# EAGLE design utophuile_i2c (EAGLE 5.07)
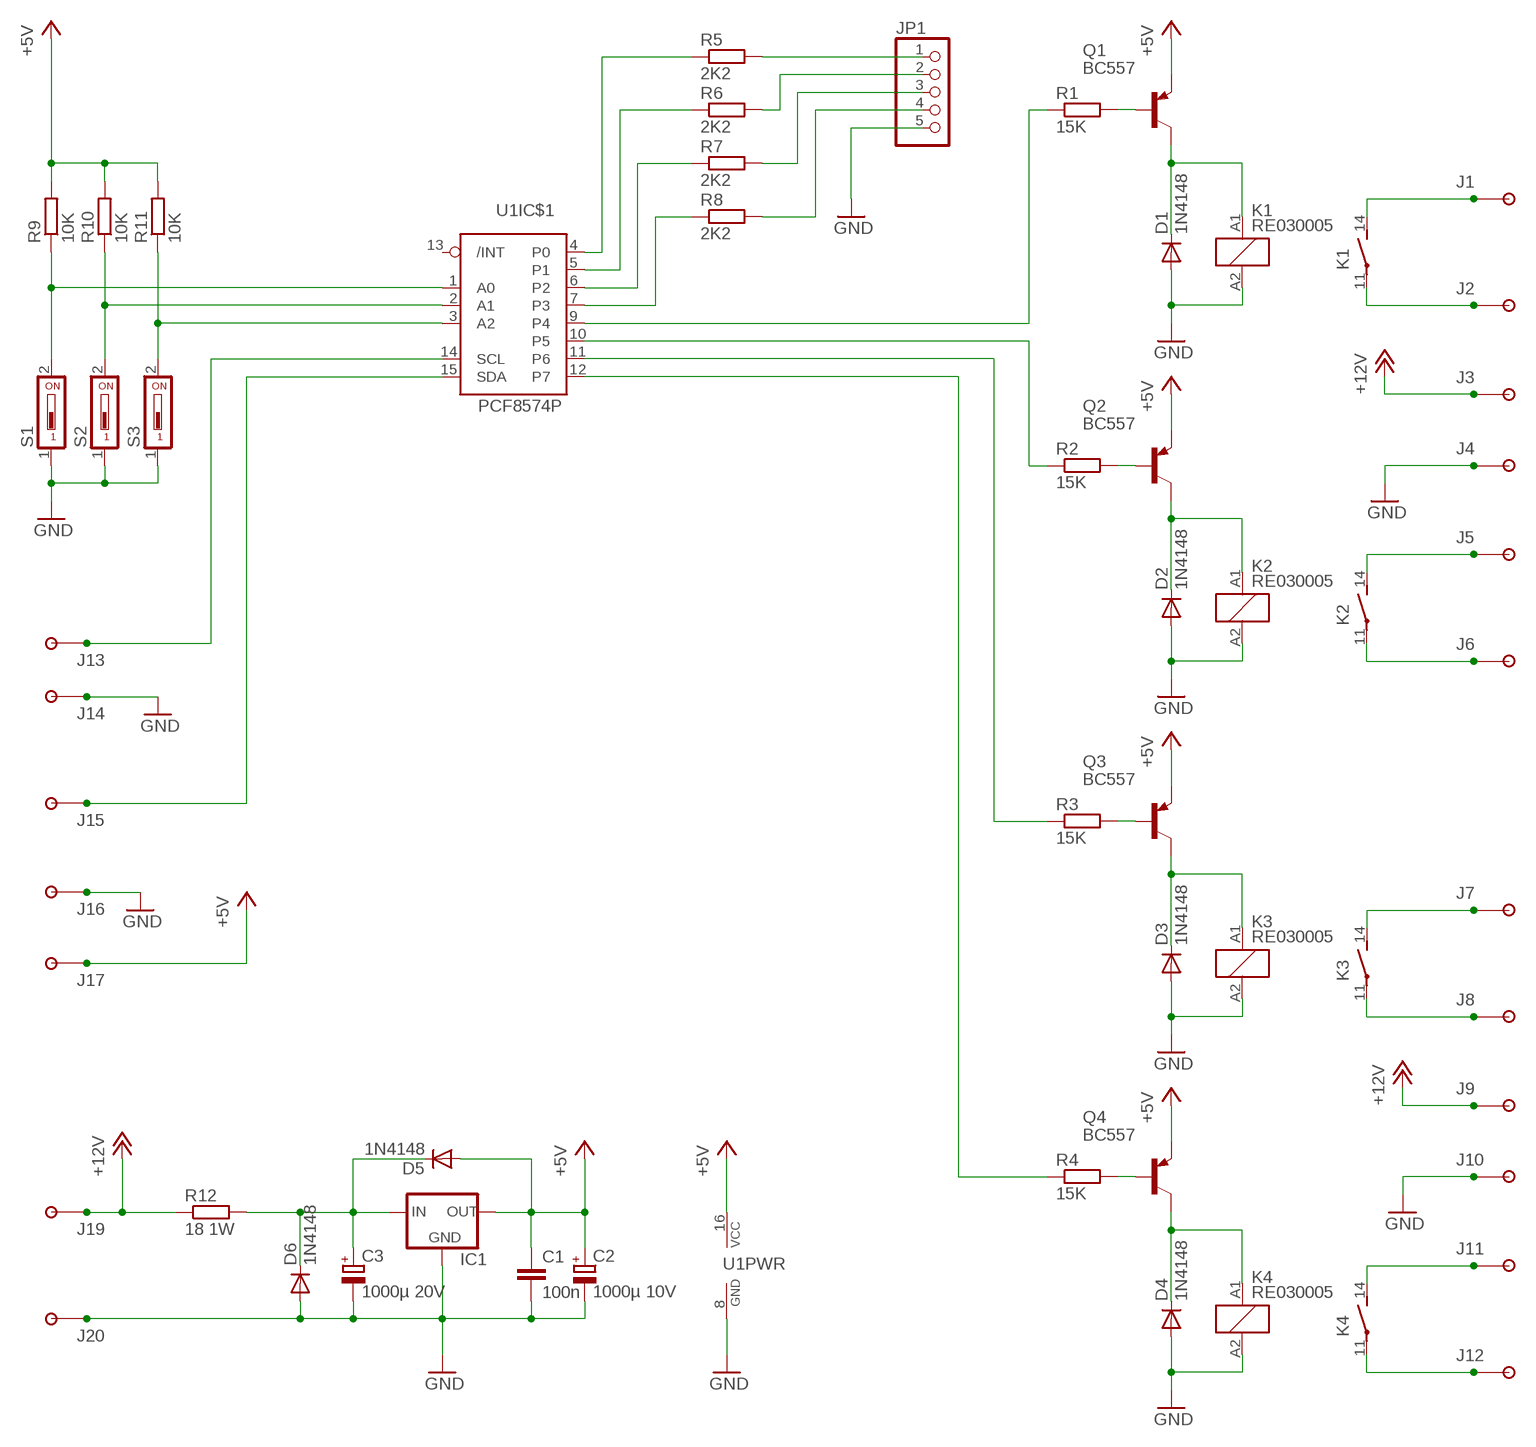
[diagram p0: schematic, sheet 1]

## Parts
C1  100n  C-EU050-025X075  [C050-025X075]
C2  1000µ 10V  CPOL-EUE3.5-10  [E3,5-10]
C3  1000µ 20V  CPOL-EUE3.5-10  [E3,5-10]
D1  1N4148  [DO35-10]
D2  1N4148  [DO35-10]
D3  1N4148  [DO35-10]
D4  1N4148  [DO35-10]
D5  1N4148  [DO35-10]
D6  1N4148  [DO35-10]
IC1  78MXXS  [78MXXS]
J1  BORN_VIS2  [BORN_VIS]
J2  BORN_VIS2  [BORN_VIS]
J3  BORN_VIS2  [BORN_VIS]
J4  BORN_VIS2  [BORN_VIS]
J5  BORN_VIS2  [BORN_VIS]
J6  BORN_VIS2  [BORN_VIS]
J7  BORN_VIS2  [BORN_VIS]
J8  BORN_VIS2  [BORN_VIS]
J9  BORN_VIS2  [BORN_VIS]
J10  BORN_VIS2  [BORN_VIS]
J11  BORN_VIS2  [BORN_VIS]
J12  BORN_VIS2  [BORN_VIS]
J13  BORN_VIS2  [BORN_VIS]
J14  BORN_VIS2  [BORN_VIS]
J15  BORN_VIS2  [BORN_VIS]
J16  BORN_VIS2  [BORN_VIS]
J17  BORN_VIS2  [BORN_VIS]
J19  BORN_VIS2  [BORN_VIS]
J20  BORN_VIS2  [BORN_VIS]
JP1  PINHD-1X5  [1X05]
K1  RE030005  [RE-SCHRACK]
K2  RE030005  [RE-SCHRACK]
K3  RE030005  [RE-SCHRACK]
K4  RE030005  [RE-SCHRACK]
Q1  BC557  [TO92-EBC]
Q2  BC557  [TO92-EBC]
Q3  BC557  [TO92-EBC]
Q4  BC557  [TO92-EBC]
R1  15K  R-EU_0207/10  [0207/10]
R2  15K  R-EU_0207/10  [0207/10]
R3  15K  R-EU_0207/10  [0207/10]
R4  15K  R-EU_0207/10  [0207/10]
R5  2K2  R-EU_0207/10  [0207/10]
R6  2K2  R-EU_0207/10  [0207/10]
R7  2K2  R-EU_0207/10  [0207/10]
R8  2K2  R-EU_0207/10  [0207/10]
R9  10K  R-EU_0207/10  [0207/10]
R10  10K  R-EU_0207/10  [0207/10]
R11  10K  R-EU_0207/10  [0207/10]
R12  18 1W  R-EU_0411/15  [0411/15]
S1  DS01  [DS-01]
S2  DS01  [DS-01]
S3  DS01  [DS-01]
U1  PCF8574P  [DIL16]

## Nets
+5V: C1.1 C2.+ D5.A IC1.OUT J17.P$1 J17.P$2 Q1.E Q2.E Q3.E Q4.E R9.2 R10.2 R11.2 U1.16(PWR:VCC)
+12V: J3.P$1 J3.P$2 J9.P$1 J9.P$2 J19.P$1 J19.P$2 R12.1
GND: C1.2 C2.- C3.- D1.A D2.A D3.A D4.A D6.A IC1.GND J4.P$1 J4.P$2 J10.P$1 J10.P$2 J14.P$1 J14.P$2 J16.P$1 J16.P$2 J20.P$1 J20.P$2 JP1.5 K1.A2 K2.A2 K3.A2 K4.A2 S1.1 S2.1 S3.1 U1.8(PWR:GND)
N$1: D4.C K4.A1 Q4.C
N$2: J11.P$1 J11.P$2 K4.14(2:S)
N$3: Q4.B R4.2
N$4: J12.P$1 J12.P$2 K4.11(2:P)
N$5: D1.C K1.A1 Q1.C
N$6: Q1.B R1.2
N$7: JP1.4 R8.2
N$8: J2.P$1 J2.P$2 K1.11(2:P)
N$9: D2.C K2.A1 Q2.C
N$10: Q2.B R2.2
N$11: J5.P$1 J5.P$2 K2.14(2:S)
N$12: J6.P$1 J6.P$2 K2.11(2:P)
N$13: D3.C K3.A1 Q3.C
N$14: Q3.B R3.2
N$15: J7.P$1 J7.P$2 K3.14(2:S)
N$16: J8.P$1 J8.P$2 K3.11(2:P)
N$17: R1.1 U1.9(IC$1:P4)
N$18: R2.1 U1.10(IC$1:P5)
N$19: R3.1 U1.11(IC$1:P6)
N$20: R4.1 U1.12(IC$1:P7)
N$21: JP1.1 R5.2
N$22: JP1.2 R6.2
N$23: JP1.3 R7.2
N$25: R5.1 U1.4(IC$1:P0)
N$26: R6.1 U1.5(IC$1:P1)
N$27: R7.1 U1.6(IC$1:P2)
N$28: R8.1 U1.7(IC$1:P3)
N$29: R9.1 S1.2 U1.1(IC$1:A0)
N$30: R10.1 S2.2 U1.2(IC$1:A1)
N$31: R11.1 S3.2 U1.3(IC$1:A2)
N$32: J1.P$1 J1.P$2 K1.14(2:S)
N$33: C3.+ D5.C D6.C IC1.IN R12.2
N$34: J13.P$1 J13.P$2 U1.14(IC$1:SCL)
N$35: J15.P$1 J15.P$2 U1.15(IC$1:SDA)
Unconnected: U1.13(IC$1:/INT)

## Library data of the parts
C1 = rcl:C-EU: CAPACITOR, European symbol
C2 C3 = rcl:CPOL-EU: POLARIZED CAPACITOR, European symbol
D1-D6 = diode:1N4148: DIODE high speed (Philips)
IC1 = v-reg:78MXXS: VOLTAGE REGULATOR
J1-J17 J19 J20 = bornnier_vis:BORN_VIS2
JP1 = pinhead:PINHD-1X5: PIN HEADER
K1-K4 = relay:RE03*: Miniature PCB Relay 1 pole 6 A SCHRACK Source: http://www.schrack.com/.. 5812.pdf
Q1-Q4 = transistor-pnp:BC557*: PNP Transistror
R1-R12 = rcl:R-EU_: RESISTOR, European symbol
S1-S3 = switch-dil:DS01: DIL/CODE SWITCH
U1 = i2c:PCF8574: Remote 8-Bit I/O Expander for I²C Bus

## Board
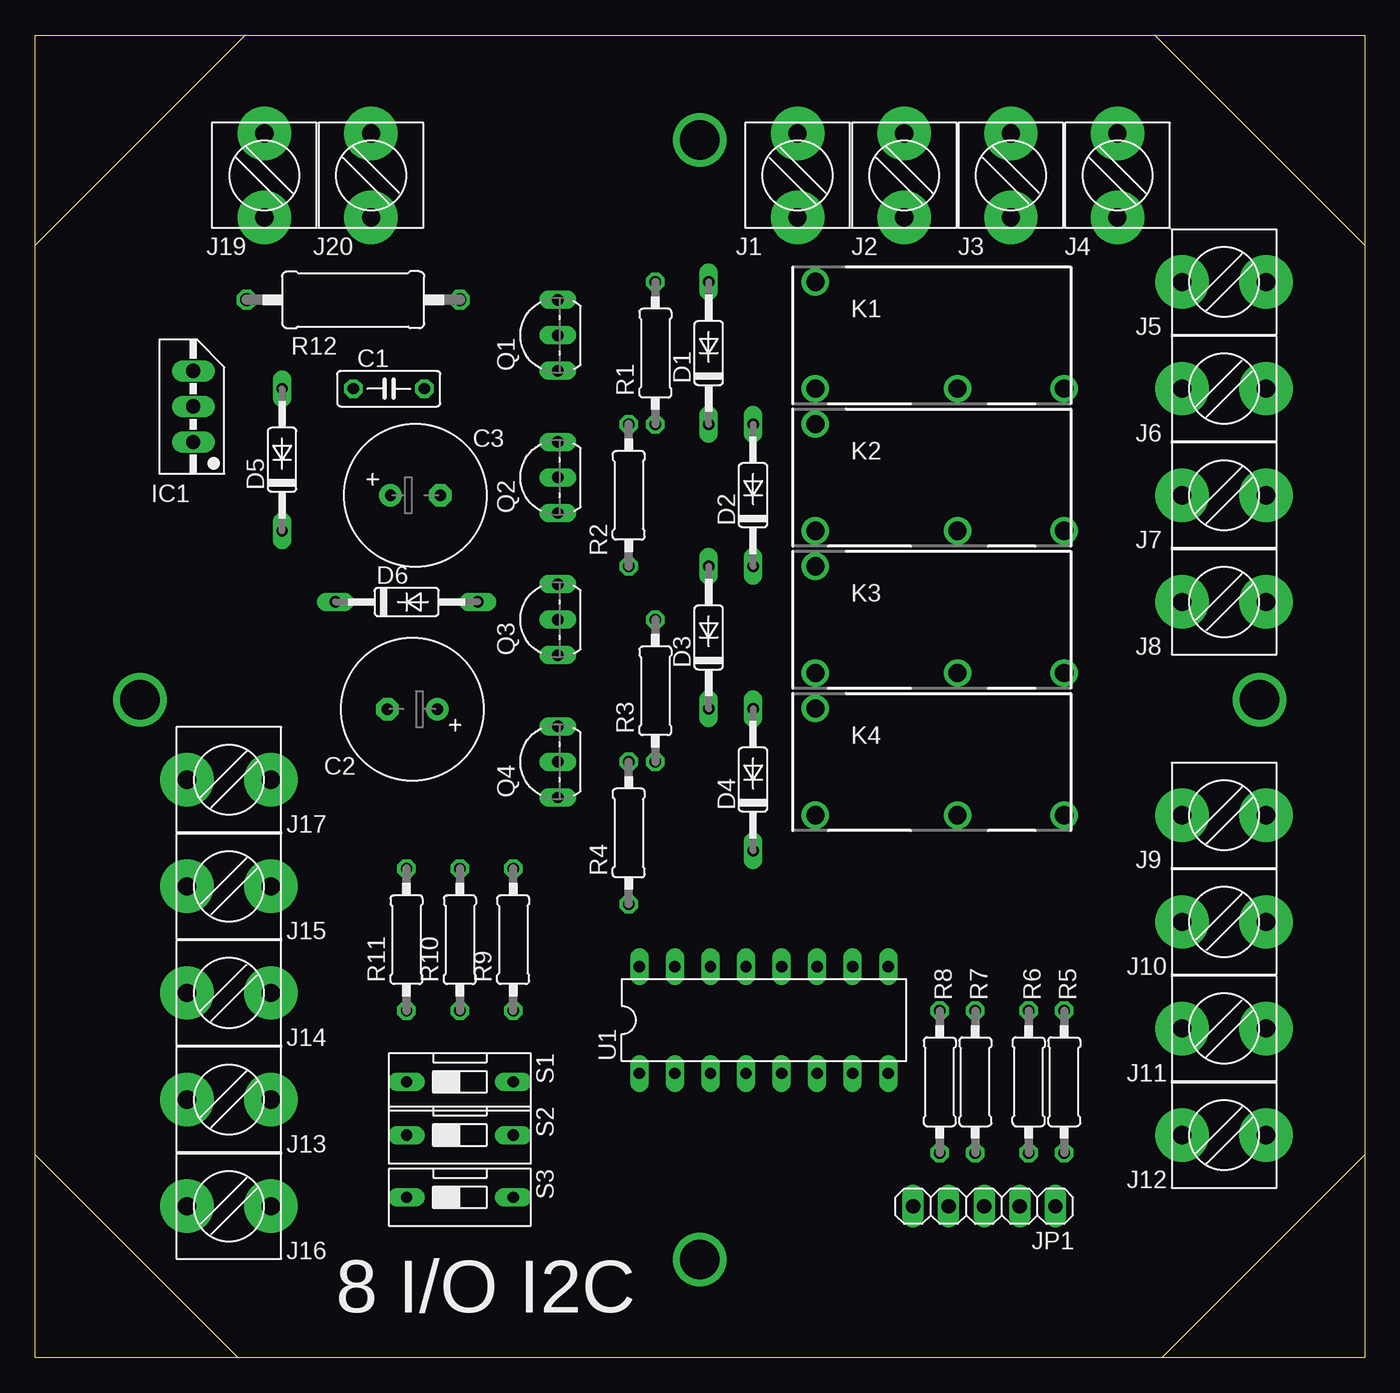
[diagram p1: board, top side]
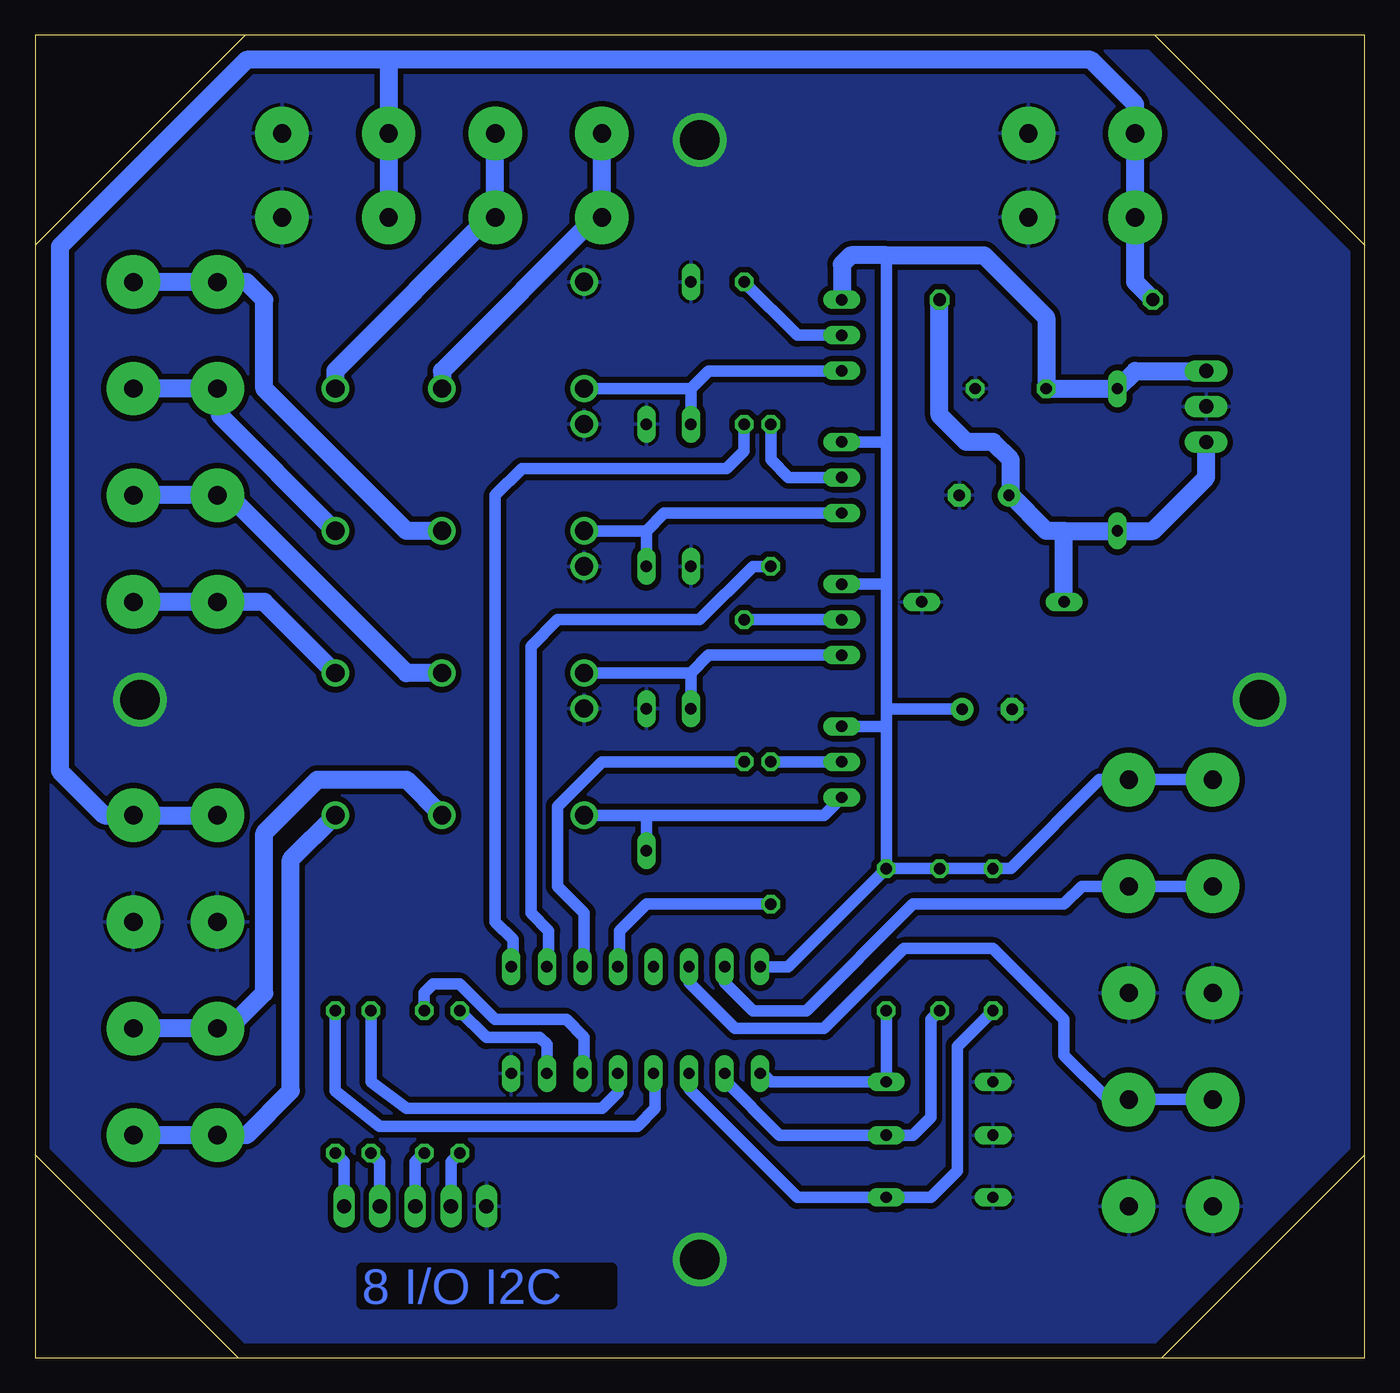
[diagram p2: board, bottom side, seen from below]

Size 95 x 94.5 mm. Coordinates in mm from the lower left corner, seen from the top.
Outline: 0,14.5 0,0 14.5,0
Outline: 0,14.5 0,79.5
Outline: 0,79.5 0,94.5 15,94.5
Outline: 15,94.5 80,94.5
Outline: 80,94.5 95,94.5 95,79.5
Outline: 95,79.5 95,14.5
Outline: 95,14.5 95,0 80.5,0
Outline: 80.5,0 14.5,0
Outline: 7.5,87 15,94.5
Outline: 15,94.5 0,79.5
Outline: 87.5,87 80,94.5
Outline: 80,94.5 95,79.5
Outline: 87.5,7 95,14.5
Outline: 95,14.5 80.5,0
Outline: 7.5,7 14.5,0
Outline: 14.5,0 0,14.5
Copper layers (1*16): Top 0.035mm / dielectric 1.5mm / Bottom 0.035mm
Design rules "default": minimum track width 10mil, minimum drill 24mil, track to track 8mil, track to pad 8mil, pad to pad 8mil, via to via 8mil, smd to smd 8mil, copper to edge 40mil, drill to drill 8mil, minimum pad ring 10mil, minimum via ring 8mil, stop-mask expansion 4mil, vias tented up to drill 0mil, thermal gap 10mil

### Footprints (pad centres in the part's own frame; a part is rotated, then mirrored left to right if it is on the bottom)
C050-025X075 = drill 0.813 octagon: 1 -2.54,0; 2 2.54,0
E3,5-10 = drill 0.813 pad 1.6 round: + -1.778,0 | drill 0.813 pad 1.6 octagon: - 1.778,0
DO35-10 = drill 0.813 long: A 5.08,0; C -5.08,0
78MXXS = drill 1.016 long: GND 0,-2.54; IN -2.54,-2.54; OUT 2.54,-2.54
BORN_VIS = drill 1.3 pad 3.81 round: P$1 -3,0; P$2 3,0
1X05 = drill 1.016 long: 1 -5.08,0; 2 -2.54,0; 3 0,0; 4 2.54,0; 5 5.08,0
RE-SCHRACK = drill 1.3 round: 11 8.89,-3.81; 14 1.27,-3.81; A1 -8.89,-3.81; A2 -8.89,3.81
TO92-EBC = drill 0.813 long: B 0,-1.27; C -2.54,-1.27; E 2.54,-1.27
0207/10 = drill 0.813 octagon: 1 -5.08,0; 2 5.08,0
0411/15 = drill 0.914 octagon: 1 -7.62,0; 2 7.62,0
DS-01 = drill 0.813 long: 1 0,-3.81; 2 0,3.81
DIL16 = drill 0.813 long: 1 -8.89,-3.81; 2 -6.35,-3.81; 3 -3.81,-3.81; 4 -1.27,-3.81; 5 1.27,-3.81; 6 3.81,-3.81; 7 6.35,-3.81; 8 8.89,-3.81; 9 8.89,3.81; 10 6.35,3.81; 11 3.81,3.81; 12 1.27,3.81; 13 -1.27,3.81; 14 -3.81,3.81; 15 -6.35,3.81; 16 -8.89,3.81

### Placement (x,y rotation side)
C1  25.28,69.23 0 top
C2  26.97,46.33 180 top
C3  27.18,61.61 0 top
D1  48.14,71.77 90 top
D2  51.31,61.61 90 top
D3  48.14,51.45 90 top
D4  51.31,41.29 90 top
D5  17.66,64.15 90 top
D6  26.55,53.99 0 top
IC1  8.77,67.96 90 top
J1  54.49,84.47 90 top
J2  62.11,84.47 90 top
J3  69.73,84.47 90 top
J4  77.35,84.47 90 top
J5  84.97,76.85 0 top
J6  84.97,69.23 0 top
J7  84.97,61.61 0 top
J8  84.97,53.99 0 top
J9  84.97,38.75 0 top
J10  84.97,31.13 0 top
J11  84.97,23.51 0 top
J12  84.97,15.89 0 top
J13  13.85,18.43 180 top
J14  13.85,26.05 180 top
J15  13.85,33.67 180 top
J16  13.85,10.81 180 top
J17  13.85,41.29 180 top
J19  16.39,84.47 90 top
J20  24.01,84.47 90 top
JP1  67.83,10.81 180 top
K1  64.65,73.04 0 top
K2  64.65,62.88 0 top
K3  64.65,52.72 0 top
K4  64.65,42.56 0 top
Q1  36.08,73.04 90 top
Q2  36.08,62.88 90 top
Q3  36.08,52.72 90 top
Q4  36.08,42.56 90 top
R1  44.33,71.77 90 top
R2  42.42,61.61 90 top
R3  44.33,47.64 90 top
R4  42.42,37.48 90 top
R5  73.54,19.7 270 top
R6  71,19.7 270 top
R7  67.19,19.7 270 top
R8  64.65,19.7 270 top
R9  34.17,29.86 90 top
R10  30.36,29.86 90 top
R11  26.55,29.86 90 top
R12  22.74,75.58 0 top
S1  30.36,19.7 270 top
S2  30.36,15.89 270 top
S3  30.36,11.45 270 top
U1  52.08,24.11 0 top

### Tracks (layer width: path | path; a pad name or v marks a point on that pad's centre or on a via)
+5V
  Bottom 0.813: 34.17,65.42 Q2.E | 34.17,65.42 34.17,78.75 | 34.17,55.26 Q3.E | 34.17,55.26 34.17,65.42 | 34.17,45.1 Q4.E | 34.17,45.1 34.17,46.37 | 34.17,46.37 34.17,55.26 | R9.2 34.17,45.1 | R9.2 R10.2 R11.2 25.28,34.94 18.93,41.29 J17.P$1 | C2.+ 34.12,46.33 34.17,46.37 | U1.16 41.19,27.92 R9.2 | J17.P$1 17.02,41.29 | J17.P$2 J17.P$1
  Bottom 1.27: IC1.OUT 16.39,70.5 D5.A C1.1 22.74,74.31 27.18,78.75 34.17,78.75 36.71,78.75 37.34,78.12 Q1.E
+12V
  Bottom 1.27: R12.1 16.39,76.85 J19.P$1 J19.P$2 16.39,87.64 | 16.39,87.64 16.39,88.28 | 81.8,38.75 J9.P$1 J9.P$2 90.05,38.75 93.22,41.92 93.22,79.39 79.89,92.72 69.73,92.72 | J3.P$1 J3.P$2 69.73,92.72 | 69.73,92.72 19.56,92.72 16.39,89.55 16.39,88.28 | 16.39,88.28 17.02,87.64 16.39,87.64
GND  (via drill 2.8 pad 3.81)
  other vias: 7.5,47 47.5,7 47.5,87 87.5,47
  pour Bottom (isolate 0.406): -0.12,14.62 -0.12,79.39 15.12,94.63 79.89,94.63 95.13,79.39 95.13,14.62 80.53,0.01 14.48,0.01
N$1
  Bottom 0.813: Q4.C 38.61,38.75 51.31,38.75 | 51.31,38.75 D4.C | 51.31,38.75 K4.A1
N$2
  Bottom 1.27: 88.78,23.51 J11.P$2 J11.P$1 81.16,23.51 78.62,26.05 78.62,37.48 74.81,41.29 68.46,41.29 K4.14
N$3
  Bottom 0.813: Q4.B R4.2
N$4
  Bottom 1.27: J12.P$2 J12.P$1 79.89,15.89 76.72,19.06 76.72,35.58 K4.11
N$5
  Bottom 0.813: Q1.C 46.87,70.5 48.14,69.23 | 48.14,69.23 D1.C | 48.14,69.23 K1.A1
N$6
  Bottom 0.813: Q1.B 40.52,73.04 R1.2
N$7
  Bottom 0.813: JP1.4 65.28,13.98 R8.2
N$8
  Bottom 1.27: 62.03,87.47 62,87.5 | 62.03,87.47 J2.P$2 | 62.11,81.93 62.11,87.39 62.03,87.47 | J2.P$1 62.11,81.93 | K1.11 73.54,70.5 62.11,81.93
N$9
  Bottom 0.813: Q2.C 50.05,60.34 51.31,59.07 | 51.31,59.07 D2.C | 51.31,59.07 K2.A1
N$10
  Bottom 0.813: Q2.B 41.16,62.88 42.42,64.15 R2.2
N$11
  Bottom 1.27: K2.14 68.46,59.07 78.62,69.23 78.62,75.58 79.89,76.85 J5.P$1 | J5.P$1 82.43,76.85 | J5.P$1 J5.P$2
N$12
  Bottom 1.27: 87.97,69.03 88,69 | 87.97,69.03 J6.P$2 J6.P$1 | 87.97,69.03 87.77,69.23 | K2.11 81.8,67.33 81.8,69.23 J6.P$1 | J6.P$1 82.43,69.23
N$13
  Bottom 0.813: Q3.C 46.87,50.18 48.14,48.91 | 48.14,48.91 D3.C | 48.14,48.91 K3.A1
N$14
  Bottom 0.813: Q3.B 43.7,52.72 R3.2
N$15
  Bottom 1.27: K3.14 68.46,48.91 81.16,61.61 J7.P$1 | J7.P$1 82.43,61.61 | J7.P$1 J7.P$2
N$16
  Bottom 1.27: 88,54 87.99,53.99 J8.P$2 J8.P$1 | K3.11 78.62,53.99 J8.P$1 | J8.P$1 82.43,53.99
N$17
  Bottom 0.813: R1.1 44.33,64.78 45.6,63.52 60.2,63.52 62.11,61.61 62.11,31.13 60.84,29.86 60.84,27.95 60.88,27.92 U1.9
N$18
  Bottom 0.813: U1.10 58.34,27.92 58.3,27.95 58.3,30.5 59.57,31.77 59.57,50.81 57.66,52.72 47.51,52.72 43.7,56.53 R2.1
N$19
  Bottom 0.813: R3.1 54.49,42.56 57.66,39.38 57.66,33.67 55.76,31.77 55.76,27.95 55.8,27.92 U1.11
N$20
  Bottom 0.813: R4.1 51.31,32.4 53.22,30.5 53.22,27.95 53.26,27.92 U1.12
N$21
  Bottom 0.813: JP1.1 72.91,13.98 R5.2
N$22
  Bottom 0.813: JP1.2 70.37,13.98 R6.2
N$23
  Bottom 0.813: JP1.3 67.83,13.98 R7.2
N$24
  Bottom 1.27: 88,69.5 87.5,69
N$25
  Bottom 0.813: R5.1 73.54,19.06 70.37,16.52 51.95,16.52 50.68,17.8 50.68,20.34 50.72,20.3 U1.4
N$26
  Bottom 0.813: U1.5 53.34,18.94 54.49,17.8 68.46,17.8 71,19.7 R6.1
N$27
  Bottom 0.813: R7.1 67.19,26.05 66.56,26.68 64.65,26.68 62.11,24.14 57.03,24.14 55.76,22.88 55.76,20.34 55.8,20.3 U1.6
N$28
  Bottom 0.813: U1.7 58.42,22.37 58.94,22.88 62.74,22.88 R8.1
N$29
  Bottom 0.813: R9.1 S1.2 42.42,19.7 43.02,20.3 U1.1
N$30
  Bottom 0.813: R10.1 31,24.14 31,17.16 32.27,15.89 S2.2 41.79,15.89 45.73,19.82 U1.2
N$31
  Bottom 0.813: R11.1 29.09,22.24 29.09,13.35 31,11.45 S3.2 40.52,11.45 48.27,19.19 U1.3
N$32
  Bottom 1.27: J1.P$1 54.49,81.93 | K1.14 65.92,70.5 54.49,81.93 | 54.49,81.93 J1.P$2
N$33
  Bottom 1.27: R12.2 30.36,67.33 28.45,65.42 26.55,65.42 25.28,64.15 25.28,61.61 | IC1.IN 11.31,62.88 15.12,59.07 D5.C 21.47,59.07 | 25.28,61.61 C3.+ | 21.47,59.07 22.74,59.07 25.28,61.61 | D6.C 21.47,59.07
N$34
  Bottom 0.813: U1.14 48.27,26.81 44.97,23.51 38.61,23.51 32.9,29.23 26.55,29.23 21.47,24.14 21.47,21.61 18.3,18.43 J13.P$1 J13.P$2
N$35
  Bottom 0.813: U1.15 45.73,26.81 43.7,24.78 39.88,24.78 32.27,32.4 21.47,32.4 20.2,33.67 J15.P$1 J15.P$2 10.68,33.67

### Text on the board
Bottom: 8 I/O I2C
tNames: 8 I/O I2C